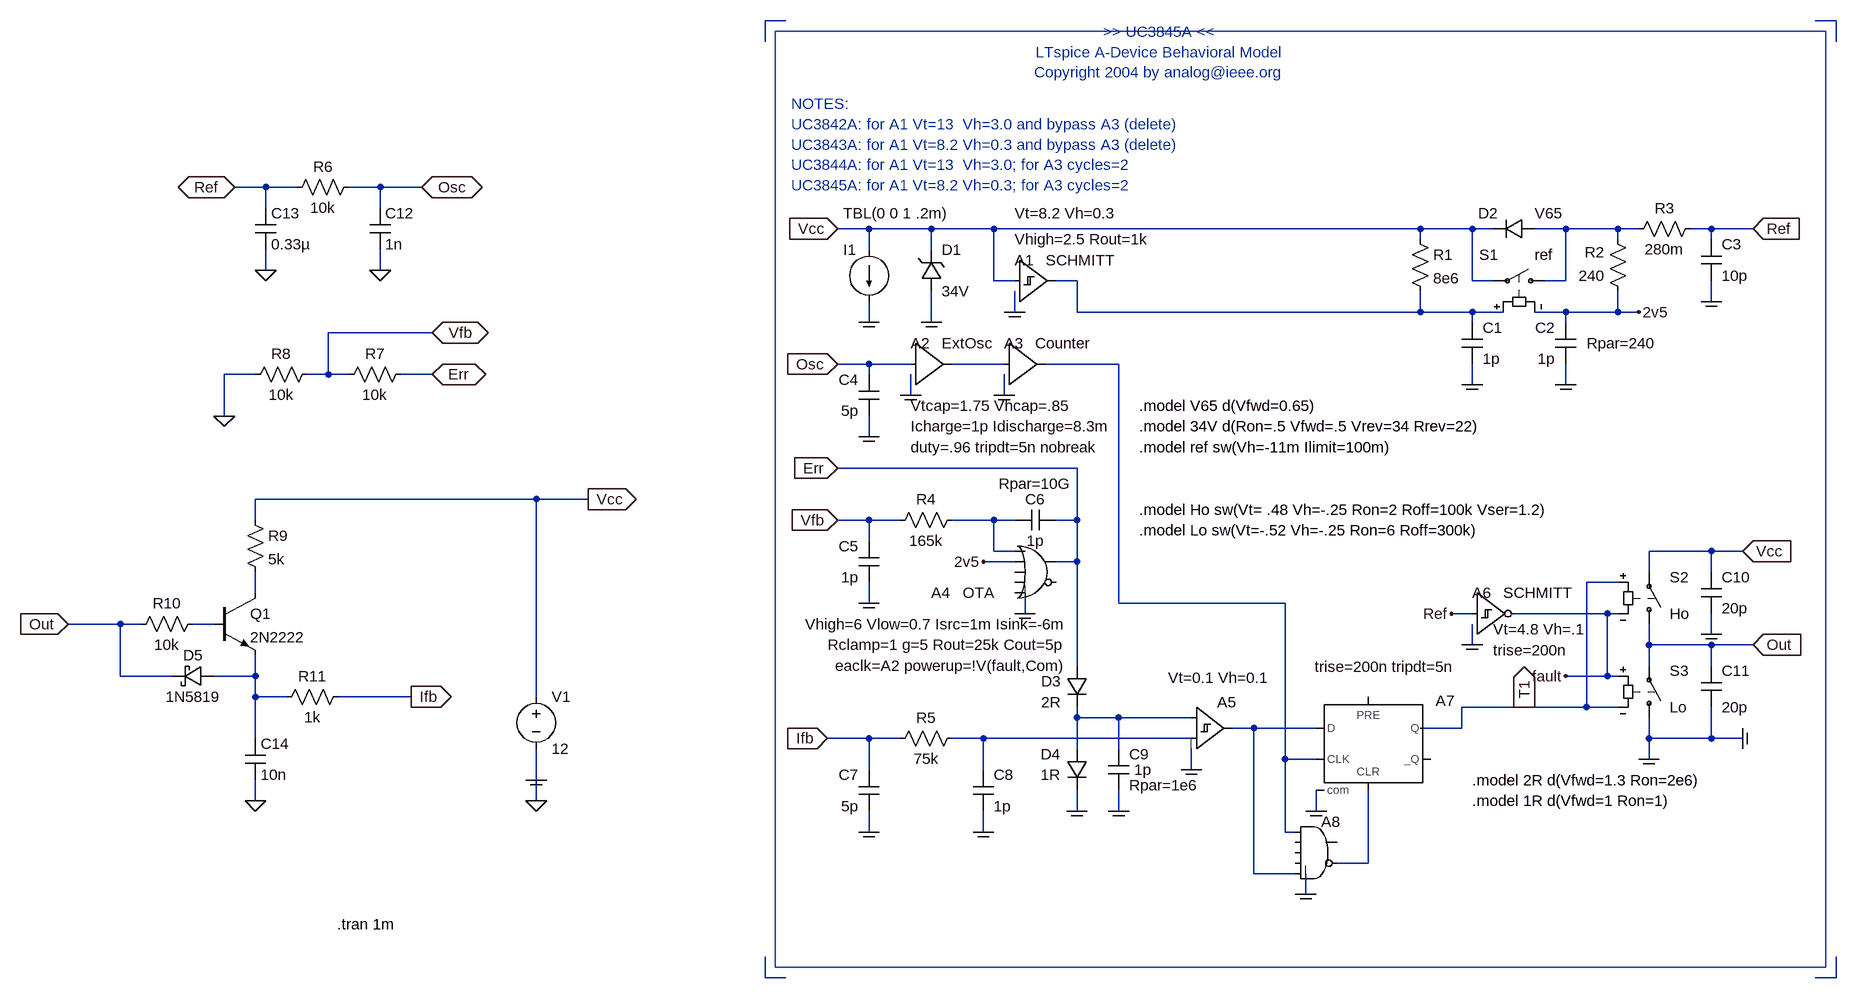
[diagram p0: schematic LT3845A-2-test.asc]
LT3845A-2-test.asc, the LTspice schematic file:
Version 4
SHEET 1 1688 948
WIRE -1456 352 -1536 352
WIRE -1456 432 -1456 352
WIRE -1424 352 -1456 352
WIRE -1376 432 -1456 432
WIRE -1312 352 -1344 352
WIRE -1296 32 -1296 -32
WIRE -1248 -32 -1296 -32
WIRE -1248 192 -1248 160
WIRE -1248 304 -1248 272
WIRE -1248 432 -1312 432
WIRE -1248 432 -1248 400
WIRE -1248 464 -1248 432
WIRE -1248 528 -1248 464
WIRE -1248 624 -1248 592
WIRE -1232 -320 -1280 -320
WIRE -1232 -288 -1232 -320
WIRE -1232 -192 -1232 -224
WIRE -1200 464 -1248 464
WIRE -1184 -320 -1232 -320
WIRE -1136 -32 -1168 -32
WIRE -1136 -32 -1136 -96
WIRE -1104 -32 -1136 -32
WIRE -1056 -320 -1104 -320
WIRE -1056 -288 -1056 -320
WIRE -1056 -192 -1056 -224
WIRE -1008 464 -1120 464
WIRE -992 -320 -1056 -320
WIRE -976 -96 -1136 -96
WIRE -976 -32 -1024 -32
WIRE -816 160 -1248 160
WIRE -816 464 -816 160
WIRE -816 592 -816 544
WIRE -816 624 -816 592
WIRE -736 160 -816 160
WIRE -464 -544 -464 -576
WIRE -464 896 -464 864
WIRE -432 -576 -464 -576
WIRE -432 896 -464 896
WIRE -304 -256 -352 -256
WIRE -304 -224 -304 -256
WIRE -304 -112 -304 -144
WIRE -304 -48 -352 -48
WIRE -304 -32 -304 -48
WIRE -304 64 -304 32
WIRE -304 192 -352 192
WIRE -304 224 -304 192
WIRE -304 320 -304 288
WIRE -304 528 -368 528
WIRE -304 576 -304 528
WIRE -304 672 -304 640
WIRE -256 192 -304 192
WIRE -256 528 -304 528
WIRE -240 -48 -304 -48
WIRE -240 0 -240 -32
WIRE -208 -256 -304 -256
WIRE -208 -224 -208 -256
WIRE -208 -112 -208 -160
WIRE -128 528 -176 528
WIRE -128 576 -128 528
WIRE -128 672 -128 640
WIRE -112 -256 -208 -256
WIRE -112 -176 -112 -256
WIRE -112 192 -176 192
WIRE -112 240 -112 192
WIRE -96 -48 -176 -48
WIRE -96 0 -96 -32
WIRE -80 -176 -112 -176
WIRE -80 -128 -80 -160
WIRE -80 192 -112 192
WIRE -80 240 -112 240
WIRE -80 256 -128 256
WIRE -64 336 -64 304
WIRE 16 -176 -16 -176
WIRE 16 -128 16 -176
WIRE 16 112 -352 112
WIRE 16 192 -16 192
WIRE 16 192 16 112
WIRE 16 256 -16 256
WIRE 16 256 16 192
WIRE 16 416 16 256
WIRE 16 496 16 480
WIRE 16 544 16 496
WIRE 16 640 16 608
WIRE 80 -48 -32 -48
WIRE 80 320 80 -48
WIRE 80 496 16 496
WIRE 80 544 80 496
WIRE 80 640 80 608
WIRE 192 496 80 496
WIRE 192 528 -128 528
WIRE 192 576 192 544
WIRE 288 512 256 512
WIRE 288 736 288 512
WIRE 336 320 80 320
WIRE 336 560 336 320
WIRE 336 672 336 560
WIRE 352 672 336 672
WIRE 352 736 288 736
WIRE 368 768 368 736
WIRE 384 512 288 512
WIRE 384 560 336 560
WIRE 384 640 384 608
WIRE 464 720 416 720
WIRE 464 720 464 608
WIRE 544 -256 -112 -256
WIRE 544 -240 544 -256
WIRE 544 -128 16 -128
WIRE 544 -128 544 -160
WIRE 608 512 544 512
WIRE 608 512 608 480
WIRE 624 -256 544 -256
WIRE 624 -176 624 -256
WIRE 624 -128 544 -128
WIRE 624 -112 624 -128
WIRE 624 -16 624 -48
WIRE 624 336 592 336
WIRE 624 384 624 352
WIRE 656 -256 624 -256
WIRE 656 -176 624 -176
WIRE 672 -128 624 -128
WIRE 704 480 608 480
WIRE 768 -256 720 -256
WIRE 768 -176 736 -176
WIRE 768 -176 768 -256
WIRE 768 -128 720 -128
WIRE 768 -112 768 -128
WIRE 768 -16 768 -48
WIRE 800 480 704 480
WIRE 800 480 800 288
WIRE 832 336 688 336
WIRE 832 432 768 432
WIRE 832 432 832 336
WIRE 848 -256 768 -256
WIRE 848 -240 848 -256
WIRE 848 -128 768 -128
WIRE 848 -128 848 -160
WIRE 848 288 800 288
WIRE 848 336 832 336
WIRE 848 432 832 432
WIRE 848 480 800 480
WIRE 880 -256 848 -256
WIRE 880 -128 848 -128
WIRE 896 272 896 240
WIRE 896 384 896 352
WIRE 896 416 896 384
WIRE 896 528 896 496
WIRE 896 560 896 528
WIRE 992 -256 960 -256
WIRE 992 -240 992 -256
WIRE 992 -144 992 -176
WIRE 992 240 896 240
WIRE 992 272 992 240
WIRE 992 368 992 336
WIRE 992 384 896 384
WIRE 992 416 992 384
WIRE 992 528 896 528
WIRE 992 528 992 480
WIRE 1040 240 992 240
WIRE 1040 528 992 528
WIRE 1056 -256 992 -256
WIRE 1056 384 992 384
WIRE 1184 -576 1152 -576
WIRE 1184 -544 1184 -576
WIRE 1184 896 1152 896
WIRE 1184 896 1184 864
FLAG 1056 384 Out
IOPIN 1056 384 In
FLAG 992 -144 COM
FLAG 1056 -256 Ref
IOPIN 1056 -256 In
FLAG -352 -48 Osc
IOPIN -352 -48 In
FLAG -128 672 COM
FLAG -352 192 Vfb
IOPIN -352 192 In
FLAG -352 112 Err
IOPIN -352 112 In
FLAG 16 640 COM
FLAG -368 528 Ifb
IOPIN -368 528 In
FLAG -304 672 COM
FLAG -304 320 COM
FLAG -304 64 COM
FLAG -128 256 2v5
FLAG -352 -256 Vcc
IOPIN -352 -256 In
FLAG 768 -16 COM
FLAG 1040 240 Vcc
IOPIN 1040 240 In
FLAG 1040 528 Com
IOPIN 1040 528 In
FLAG 992 368 COM
FLAG 880 -128 2v5
FLAG 592 336 Ref
FLAG 80 640 COM
FLAG -208 -112 COM
FLAG 624 -16 COM
FLAG 768 432 fault
FLAG -304 -112 COM
FLAG 624 384 COM
FLAG -64 336 COM
FLAG 368 768 COM
FLAG -240 0 COM
FLAG -80 -128 COM
FLAG 896 560 COM
FLAG 192 576 COM
FLAG 384 640 COM
FLAG 704 480 T1
IOPIN 704 480 Out
FLAG -96 0 COM
FLAG -1056 -192 0
FLAG -992 -320 Osc
IOPIN -992 -320 BiDir
FLAG -1280 -320 Ref
IOPIN -1280 -320 BiDir
FLAG -1232 -192 0
FLAG -1296 32 0
FLAG -976 -32 Err
IOPIN -976 -32 BiDir
FLAG -976 -96 Vfb
IOPIN -976 -96 BiDir
FLAG -736 160 Vcc
IOPIN -736 160 Out
FLAG -816 624 0
FLAG -1248 624 0
FLAG -1008 464 Ifb
IOPIN -1008 464 Out
FLAG -1536 352 Out
IOPIN -1536 352 In
FLAG -816 592 Com
SYMBOL current -304 -224 R0
WINDOW 3 -40 -56 Left 0
WINDOW 123 0 0 Left 0
WINDOW 39 0 0 Left 0
WINDOW 0 -40 0 Left 0
SYMATTR Value TBL(0 0 1 .2m)
SYMATTR InstName I1
SYMBOL zener -224 -160 M180
WINDOW 0 32 64 Left 0
WINDOW 3 32 0 Left 0
SYMATTR InstName D1
SYMATTR Value 34V
SYMBOL Digital\\schmtbuf -80 -240 R0
WINDOW 0 0 32 Left 0
WINDOW 3 0 -40 Left 0
WINDOW 38 48 32 Left 0
WINDOW 123 0 0 Left 0
SYMATTR InstName A1
SYMATTR Value Vt=8.2 Vh=0.3
SYMATTR Value2 Vhigh=2.5 Rout=1k
SYMBOL res 528 -256 R0
SYMATTR InstName R1
SYMATTR Value 8e6
SYMBOL cap 608 -112 R0
WINDOW 0 32 8 Left 0
WINDOW 3 32 56 Left 0
SYMATTR InstName C1
SYMATTR Value 1p
SYMBOL sw 752 -176 M270
WINDOW 0 40 88 VRight 0
WINDOW 3 40 32 VLeft 0
SYMATTR InstName S1
SYMATTR Value ref
SYMBOL diode 720 -272 R90
WINDOW 0 -8 56 VRight 0
WINDOW 3 -8 0 VLeft 0
SYMATTR InstName D2
SYMATTR Value V65
SYMBOL cap 784 -112 M0
WINDOW 3 32 56 Left 0
WINDOW 39 -16 32 Right 0
WINDOW 0 32 8 Left 0
SYMATTR Value 1p
SYMATTR SpiceLine Rpar=240
SYMATTR InstName C2
SYMBOL res 864 -144 R180
WINDOW 0 36 76 Left 0
WINDOW 3 36 40 Left 0
SYMATTR InstName R2
SYMATTR Value 240
SYMBOL res 976 -272 R90
WINDOW 0 0 56 VBottom 0
WINDOW 3 32 56 VTop 0
SYMATTR InstName R3
SYMATTR Value 280m
SYMBOL cap 976 -176 M180
WINDOW 0 32 56 Left 0
WINDOW 3 32 8 Left 0
SYMATTR InstName C3
SYMATTR Value 10p
SYMBOL cap -288 -32 M0
WINDOW 3 32 56 Left 0
WINDOW 0 32 8 Left 0
SYMATTR Value 5p
SYMATTR InstName C4
SYMBOL Digital\\buf1 -240 -112 R0
WINDOW 3 0 128 Left 0
WINDOW 38 48 32 Left 0
WINDOW 0 0 32 Left 0
WINDOW 123 0 160 Left 0
WINDOW 39 0 192 Left 0
SYMATTR Value Vtcap=1.75 Vhcap=.85
SYMATTR SpiceModel ExtOsc
SYMATTR InstName A2
SYMATTR Value2 Icharge=1p Idischarge=8.3m
SYMATTR SpiceLine duty=.96 tripdt=5n nobreak
SYMBOL cap -288 224 M0
WINDOW 0 32 8 Left 0
WINDOW 3 32 56 Left 0
SYMATTR InstName C5
SYMATTR Value 1p
SYMBOL res -160 176 R90
WINDOW 0 0 56 VBottom 0
WINDOW 3 32 56 VTop 0
SYMATTR InstName R4
SYMATTR Value 165k
SYMBOL cap -16 176 R90
WINDOW 0 0 32 VBottom 0
WINDOW 3 32 32 VTop 0
WINDOW 39 -40 32 VCenter 0
SYMATTR InstName C6
SYMATTR Value 1p
SYMATTR SpiceLine Rpar=10G
SYMBOL Digital\\or -48 208 R0
WINDOW 0 -160 96 Left 0
WINDOW 38 -112 96 Left 0
WINDOW 3 48 144 Right 0
WINDOW 123 48 176 Right 0
WINDOW 39 48 208 Right 0
SYMATTR InstName A4
SYMATTR SpiceModel OTA
SYMATTR Value Vhigh=6 Vlow=0.7 Isrc=1m Isink=-6m
SYMATTR Value2 Rclamp=1 g=5 Rout=25k Cout=5p
SYMATTR SpiceLine eaclk=A2 powerup=!V(fault,Com)
SYMBOL cap -288 576 M0
WINDOW 0 32 8 Left 0
WINDOW 3 32 56 Left 0
SYMATTR InstName C7
SYMATTR Value 5p
SYMBOL res -160 512 R90
WINDOW 0 0 56 VBottom 0
WINDOW 3 32 56 VTop 0
SYMATTR InstName R5
SYMATTR Value 75k
SYMBOL cap -144 576 R0
WINDOW 0 32 8 Left 0
WINDOW 3 32 56 Left 0
SYMATTR InstName C8
SYMATTR Value 1p
SYMBOL diode 32 416 M0
WINDOW 3 40 56 Left 0
WINDOW 0 40 24 Left 0
SYMATTR Value 2R
SYMATTR InstName D3
SYMBOL diode 32 544 M0
WINDOW 3 41 40 Left 0
WINDOW 0 41 8 Left 0
SYMATTR Value 1R
SYMATTR InstName D4
SYMBOL cap 64 544 R0
WINDOW 0 32 8 Left 0
WINDOW 3 40 32 Left 0
WINDOW 39 32 56 Left 0
SYMATTR InstName C9
SYMATTR Value 1p
SYMATTR SpiceLine Rpar=1e6
SYMBOL Digital\\schmtinv 624 272 R0
WINDOW 0 0 32 Left 0
WINDOW 3 32 88 Left 0
WINDOW 38 48 32 Left 0
WINDOW 123 32 120 Left 0
SYMATTR InstName A6
SYMATTR Value Vt=4.8 Vh=.1
SYMATTR Value2 trise=200n
SYMBOL sw 896 368 M180
WINDOW 0 32 88 Left 0
WINDOW 3 32 32 Left 0
SYMATTR InstName S2
SYMATTR Value Ho
SYMBOL sw 896 512 M180
WINDOW 0 32 88 Left 0
WINDOW 3 32 32 Left 0
SYMATTR InstName S3
SYMATTR Value Lo
SYMBOL cap 976 272 R0
WINDOW 3 32 56 Left 0
WINDOW 0 32 8 Left 0
SYMATTR Value 20p
SYMATTR InstName C10
SYMBOL cap 976 416 R0
WINDOW 0 32 8 Left 0
WINDOW 3 32 64 Left 0
SYMATTR InstName C11
SYMATTR Value 20p
SYMBOL Digital\\diffschmtbuf 192 448 R0
WINDOW 3 -36 -13 Left 0
SYMATTR Value Vt=0.1 Vh=0.1
SYMATTR InstName A5
SYMBOL Digital\\dflop 464 464 R0
WINDOW 3 -82 -46 Left 0
SYMATTR Value trise=200n tripdt=5n
SYMATTR InstName A7
SYMBOL Digital\\and 384 640 R0
SYMATTR InstName A8
SYMBOL Digital\\buf1 -96 -112 R0
WINDOW 38 48 32 Left 0
WINDOW 0 0 32 Left 0
WINDOW 3 0 0 Invisible 0
SYMATTR SpiceModel Counter
SYMATTR InstName A3
SYMATTR Value cycles=2
SYMBOL cap -1072 -288 R0
SYMATTR InstName C12
SYMATTR Value 1n
SYMBOL res -1088 -336 R90
WINDOW 0 0 56 VBottom 0
WINDOW 3 32 56 VTop 0
SYMATTR InstName R6
SYMATTR Value 10k
SYMBOL cap -1248 -288 R0
SYMATTR InstName C13
SYMATTR Value 0.33µ
SYMBOL res -1008 -48 R90
WINDOW 0 0 56 VBottom 0
WINDOW 3 32 56 VTop 0
SYMATTR InstName R7
SYMATTR Value 10k
SYMBOL res -1152 -48 R90
WINDOW 0 0 56 VBottom 0
WINDOW 3 32 56 VTop 0
SYMATTR InstName R8
SYMATTR Value 10k
SYMBOL voltage -816 448 R0
WINDOW 123 0 0 Left 0
WINDOW 39 0 0 Left 0
SYMATTR InstName V1
SYMATTR Value 12
SYMBOL res -1264 176 R0
SYMATTR InstName R9
SYMATTR Value 5k
SYMBOL npn -1312 304 R0
SYMATTR InstName Q1
SYMATTR Value 2N2222
SYMBOL cap -1264 528 R0
SYMATTR InstName C14
SYMATTR Value 10n
SYMBOL res -1328 336 R90
WINDOW 0 0 56 VBottom 0
WINDOW 3 32 56 VTop 0
SYMATTR InstName R10
SYMATTR Value 10k
SYMBOL schottky -1312 416 R90
WINDOW 0 0 32 VBottom 0
WINDOW 3 32 32 VTop 0
SYMATTR InstName D5
SYMATTR Value 1N5819
SYMATTR Description Diode
SYMATTR Type diode
SYMBOL res -1104 448 R90
WINDOW 0 0 56 VBottom 0
WINDOW 3 32 56 VTop 0
SYMATTR InstName R11
SYMATTR Value 1k
TEXT 624 624 Left 0 !.model 1R d(Vfwd=1 Ron=1)
TEXT 624 592 Left 0 !.model 2R d(Vfwd=1.3 Ron=2e6)
TEXT 112 48 Left 0 !.model 34V d(Ron=.5 Vfwd=.5 Vrev=34 Rrev=22)
TEXT 112 80 Left 0 !.model ref sw(Vh=-11m Ilimit=100m)
TEXT 112 176 Left 0 !.model Ho sw(Vt= .48 Vh=-.25 Ron=2 Roff=100k Vser=1.2)
TEXT 112 208 Left 0 !.model Lo sw(Vt=-.52 Vh=-.25 Ron=6 Roff=300k)
TEXT 112 16 Left 0 !.model V65 d(Vfwd=0.65)
TEXT 144 -528 Center 0 ;>> UC3845A <<\nLTspice A-Device Behavioral Model\nCopyright 2004 by analog@ieee.org
TEXT -424 -448 Left 0 ;NOTES:\nUC3842A: for A1 Vt=13  Vh=3.0 and bypass A3 (delete)\nUC3843A: for A1 Vt=8.2 Vh=0.3 and bypass A3 (delete)\nUC3844A: for A1 Vt=13  Vh=3.0; for A3 cycles=2\nUC3845A: for A1 Vt=8.2 Vh=0.3; for A3 cycles=2
TEXT -1122 814 Left 0 !.tran 1m
RECTANGLE Normal 1168 880 -448 -560

The netlist it stands for:
* LT3845A-2-test.asc
I1 Vcc 0 TBL(0 0 1 .2m)
D1 0 Vcc 34V
A1 Vcc 0 0 0 0 0 N009 0 SCHMITT Vt=8.2 Vh=0.3 Vhigh=2.5 Rout=1k
R1 Vcc N009 8e6
C1 N009 0 1p
S1 N014 Vcc N009 2v5 ref
D2 N014 Vcc V65
C2 2v5 0 1p Rpar=240
R2 2v5 N014 240
R3 Ref N014 280m
C3 0 Ref 10p
C4 Osc 0 5p
A2 Osc 0 0 0 0 0 N008 0 ExtOsc Vtcap=1.75 Vhcap=.85 Icharge=1p Idischarge=8.3m duty=.96 tripdt=5n nobreak
C5 Vfb 0 1p
R4 N007 Vfb 165k
C6 Err N007 1p Rpar=10G
A4 N007 2v5 0 0 0 0 Err 0 OTA Vhigh=6 Vlow=0.7 Isrc=1m Isink=-6m Rclamp=1 g=5 Rout=25k Cout=5p eaclk=A2 powerup=!V(fault,Com)
C7 Ifb 0 5p
R5 N006 Ifb 75k
C8 N006 0 1p
D3 Err N010 2R
D4 N010 0 1R
C9 N010 0 1p Rpar=1e6
A6 Ref 0 0 0 0 fault 0 0 SCHMITT Vt=4.8 Vh=.1 trise=200n
S2 Out Vcc T1 fault Ho
S3 0 Out fault T1 Lo
C10 Vcc 0 20p
C11 Out 0 20p
A5 N010 N006 0 0 0 0 N012 0 SCHMITT Vt=0.1 Vh=0.1
A7 N012 0 N011 0 N013 0 T1 0 DFLOP trise=200n tripdt=5n
A8 N011 0 0 0 N012 N013 0 0 AND
A3 N008 0 0 0 0 0 N011 0 Counter cycles=2
C12 Osc 0 1n
R6 Osc Ref 10k
C13 Ref 0 0.33µ
R7 Err Vfb 10k
R8 Vfb 0 10k
V1 Vcc 0 12
R9 Vcc N002 5k
Q1 N002 N001 N003 0 2N2222
C14 N003 0 10n
R10 N001 Out 10k
D5 N003 Out 1N5819
R11 Ifb N003 1k
.model D D
.lib standard.dio
.model NPN NPN
.model PNP PNP
.lib standard.bjt
.model 1R d(Vfwd=1 Ron=1)
.model 2R d(Vfwd=1.3 Ron=2e6)
.model 34V d(Ron=.5 Vfwd=.5 Vrev=34 Rrev=22)
.model ref sw(Vh=-11m Ilimit=100m)
.model Ho sw(Vt= .48 Vh=-.25 Ron=2 Roff=100k Vser=1.2)
.model Lo sw(Vt=-.52 Vh=-.25 Ron=6 Roff=300k)
.model V65 d(Vfwd=0.65)
* >> UC3845A <<
* LTspice A-Device Behavioral Model
* Copyright 2004 by analog@ieee.org
* NOTES:
* UC3842A: for A1 Vt=13  Vh=3.0 and bypass A3 (delete)
* UC3843A: for A1 Vt=8.2 Vh=0.3 and bypass A3 (delete)
* UC3844A: for A1 Vt=13  Vh=3.0; for A3 cycles=2
* UC3845A: for A1 Vt=8.2 Vh=0.3; for A3 cycles=2
.tran 1m
.backanno
.end